# EasyEDA Pro project Photodetector_v2_1.eprj

# Schematic Schematic1
Board Name: Board1; Create Date: 2025-05-13; Page Name: P1; Project Name: Photodetector_v2; Schematic Name: Schematic1; Update Date: 2025-06-02; Company: EasyEDA.com; Page Size: A4; Version: V1.0
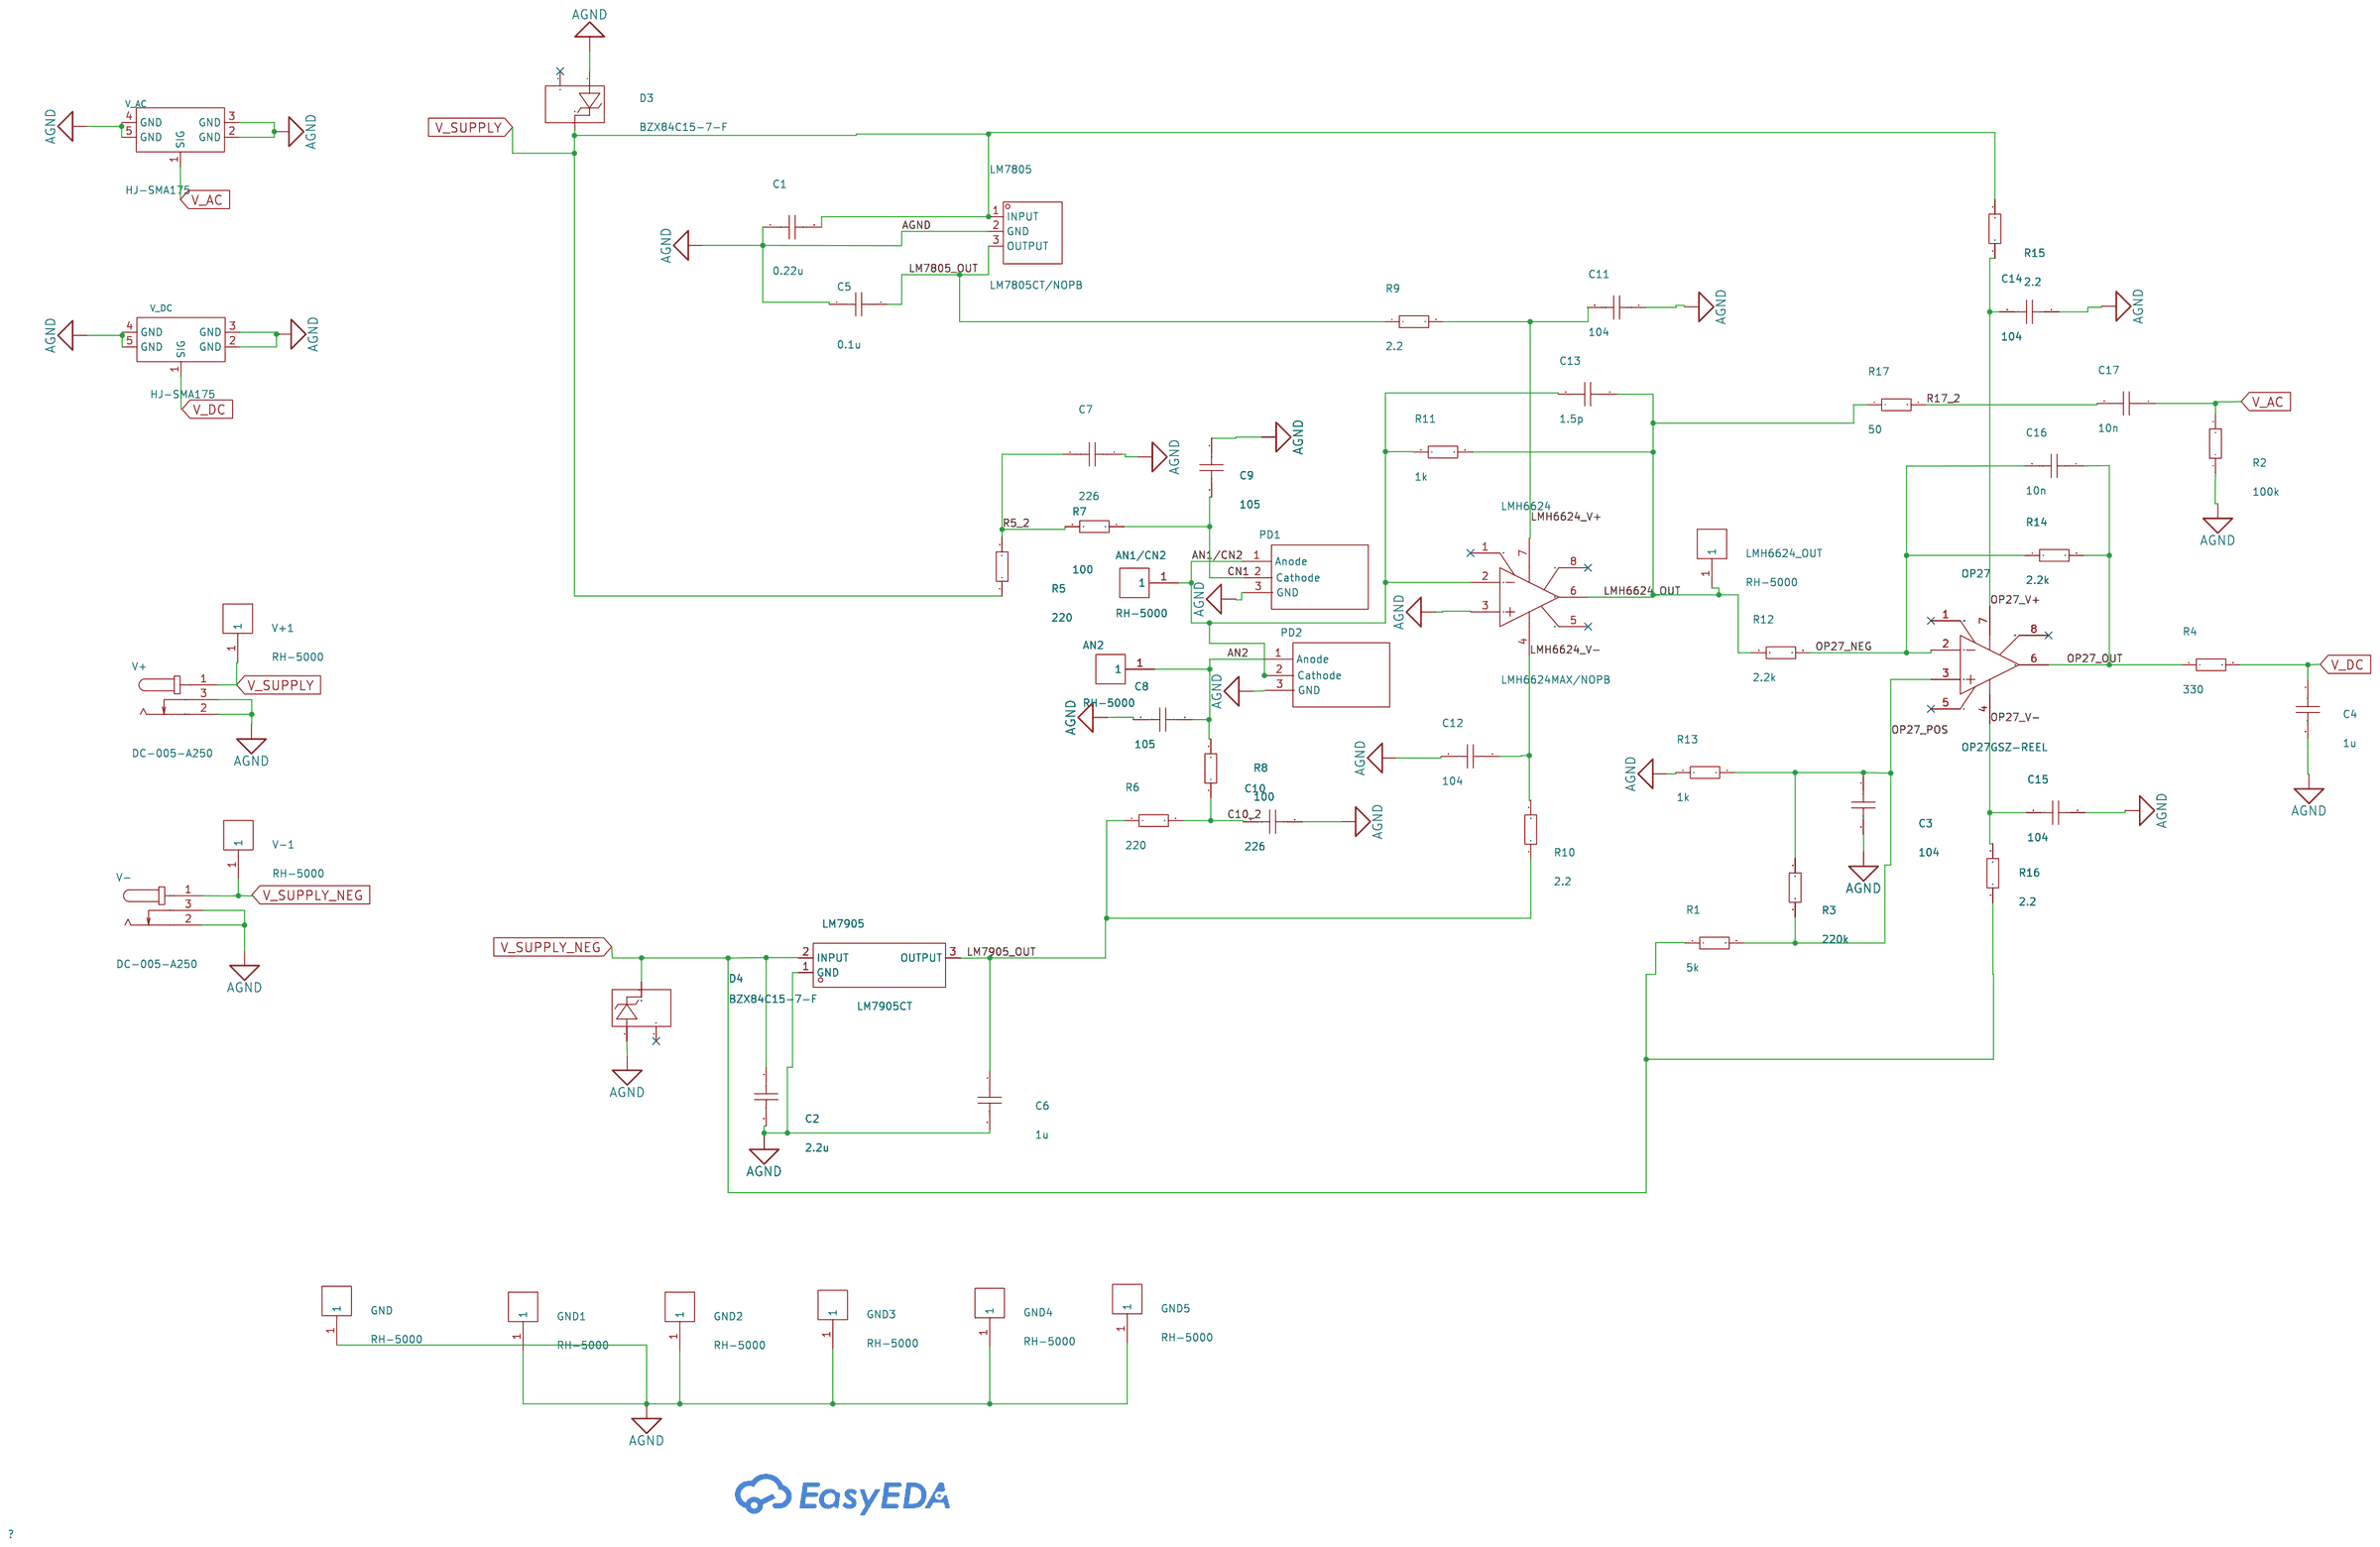
[diagram p0: schematic sheet]

## Parts
AN1/CN2  RH-5000  [TEST-TH_BD2.54-P1.4_RED]
AN2  RH-5000  [TEST-TH_BD2.54-P1.4_RED]
C1  0.22u  [C0603]
C2  2.2u  [C0603]
C3  104  [C0603]
C4  1u  [C0603]
C5  0.1u  [C0603]
C6  1u  [C0603]
C7  226  [C0603]
C8  105  [C0603]
C9  105  [C0603]
C10  226  [C0603]
C11  104  [C0603]
C12  104  [C0603]
C13  1.5p  [C0603]
C14  104  [C0603]
C15  104  [C0603]
C16  10n  [C0603]
C17  10n  [C0603]
D3  BZX84C15-7-F  [SOT-23-3_L2.9-W1.3-P1.90-LS2.4-BR]
D4  BZX84C15-7-F  [SOT-23-3_L2.9-W1.3-P1.90-LS2.4-BR]
GND  RH-5000  [TEST-TH_BD2.54-P1.4_RED]
GND1  RH-5000  [TEST-TH_BD2.54-P1.4_RED]
GND2  RH-5000  [TEST-TH_BD2.54-P1.4_RED]
GND3  RH-5000  [TEST-TH_BD2.54-P1.4_RED]
GND4  RH-5000  [TEST-TH_BD2.54-P1.4_RED]
GND5  RH-5000  [TEST-TH_BD2.54-P1.4_RED]
LM7805  LM7805CT/NOPB  [TO-220-3_L10.0-W4.5-P2.54-T]
LM7905  LM7905CT  [TO-220-3_L9.9-W4.5-P2.54-L]
LMH6624  LMH6624MAX/NOPB  [SOIC-8_L4.9-W3.9-P1.27-LS6.0-BL]
LMH6624_OUT  RH-5000  [TEST-TH_BD2.54-P1.4_RED]
OP27  OP27GSZ-REEL  [SOIC-8_L4.9-W3.9-P1.27-LS6.0-BL]
PD1  -  [HQE Detector]
PD2  -  [HQE Detector]
R1  5k  [R0603]
R2  100k  [R0603]
R3  220k  [R0603]
R4  330  [R0603]
R5  220  [R0603]
R6  220  [R0603]
R7  100  [R0603]
R8  100  [R0603]
R9  2.2  [R0603]
R10  2.2  [R0603]
R11  1k  [R0603]
R12  2.2k  [R0603]
R13  1k  [R0603]
R14  2.2k  [R0603]
R15  2.2  [R0603]
R16  2.2  [R0603]
R17  50  [R0603]
V+  DC-005-A250  [DC-IN-TH_DC-005-A250]
V+1  RH-5000  [TEST-TH_BD2.54-P1.4_RED]
V-  DC-005-A250  [DC-IN-TH_DC-005-A250]
V-1  RH-5000  [TEST-TH_BD2.54-P1.4_RED]
V_AC  HJ-SMA175  [SMA-TH_HJ-SMA175]
V_DC  HJ-SMA175  [SMA-TH_HJ-SMA175]

## Library data of the parts
AN1/CN2 AN2 GND GND1-GND5 LMH6624_OUT V+1 V-1 = RH-5000: LCSC Part Name: PCB电路板测试点/测试针; Supplier Part: C5277086; Manufacturer: 荣和; JLCPCB Part Class: Extended Part; Datasheet: https://atta.szlcsc.com/upload/public/pdf/source/20230704/1671C2774A3D6CEDC1FD6AAF48538C87.pdf; Supplier: LCSC
C1-C17 = CAP_0603: Supplier Footprint: 0603
D3 D4 = BZX84C15-7-F: Diode Configuration:Single Zener Voltage (Nom):15V Reverse Leakage Current (Ir):100nA@10.5V Zener Voltage (Range):13.8V~15.6V Zener Voltage (Range):13.8V~15.6V Power Dissipation:300mW Zener Impedance (Zzt):30Ω Tolerance:±6% Tolerance:±6%; Supplier Part: C500789; Manufacturer: DIODES(美台); Supplier Footprint: SOT-23; JLCPCB Part Class: Extended Part; Datasheet: https://atta.szlcsc.com/upload/public/pdf/source/20191127/C460825_8B7CE8DA99B73E2871EF5DDF3D9CE9A8.pdf; Supplier: LCSC; Diode Configuration: Single; Zener Voltage (Nom): 15V; Reverse Leakage Current (Ir): 100nA@10.5V; Zener Voltage (Range): 13.8V~15.6V; Power Dissipation: 300mW; Zener Impedance (Zzt): 30Ω; Tolerance: ±6%
LM7805 = LM7805CT/NOPB: Output Type:Fixed Maximum Input Voltage:35V Output Voltage:5V Output Voltage:5V Output Current:1A Power Supply Rejection Ratio (PSRR):80dB@(120Hz) Dropout Voltage:2V@(1A) standby current:6mA Feature:防静电保护；Short-Circuit  Protection；Thermal Protection(TSD)；; LCSC Part Name: 1.5A、30V 线性稳压器; Supplier Part: C50931; Manufacturer: TI(德州仪器); Supplier Footprint: TO-220; JLCPCB Part Class: Extended Part; Datasheet: https://www.ti.com/cn/lit/gpn/lm7800; Supplier: LCSC; Output Type: Fixed; Maximum Input Voltage: 35V; Output Voltage: 5V; Output Current: 1A; Power Supply Rejection Ratio (PSRR): 80dB@(120Hz); Dropout Voltage: 2V@(1A); standby current: 6mA; Feature: 防静电保护；Short-Circuit  Protection；Thermal Protection(TSD)；Overcurrent Protection(OCP)；带使能; Operating Temperature: 0℃~+125℃; Output Polarity: Positive electrode; Number of Outputs: 1
LM7905 = LM7905CT_C7432217: Output Type:Fixed Maximum Input Voltage:35V Output Voltage:5V Output Voltage:5V Output Current:1.5A Power Supply Rejection Ratio (PSRR):60dB@(120Hz) Operating Temperature:-20℃~+125℃@(Ta) Operating Temperature:-20℃~+125℃@(Ta) Output Polarity:Negative elect; Supplier Part: C7432217; Manufacturer: HGSEMI(华冠); Supplier Footprint: TO-220-3; JLCPCB Part Class: Extended Part; Datasheet: https://atta.szlcsc.com/upload/public/pdf/source/20231018/5BB71A5A92E7CAA6C954476BD60B4068.pdf; Supplier: LCSC; Output Type: Fixed; Maximum Input Voltage: 35V; Output Voltage: 5V; Output Current: 1.5A; Power Supply Rejection Ratio (PSRR): 60dB@(120Hz); Operating Temperature: -20℃~+125℃@(Ta); Output Polarity: Negative electrode; Number of Outputs: 1
LMH6624 = LMH6624MAX/NOPB: Supplier Part: C486023; Manufacturer: TI(德州仪器); Supplier Footprint: SOIC-8; JLCPCB Part Class: Extended Part; Datasheet: https://www.ti.com/cn/lit/gpn/lmh6624; Supplier: LCSC
OP27 = OP27GSZ-REEL: Number of Circuits:单路 Gain Bandwidth Product(GBP):8MHz Current - Input Bias(Ib):15nA Slew Rate(SR):2.8V/us Output Current:- -3db Bandwidth:- Operating Temperature:-40℃~+85℃ Operating Temperature:-40℃~+85℃; Supplier Part: C581242; Manufacturer: ADI(亚德诺); Supplier Footprint: SOIC-8; JLCPCB Part Class: Extended Part; Datasheet: https://atta.szlcsc.com/upload/public/pdf/source/20190807/C408903_306E85C5C164A1857E665ACBE0030C2C.pdf; Supplier: LCSC; Number of Circuits: 单路; Gain Bandwidth Product(GBP): 8MHz; Current - Input Bias(Ib): 15nA; Slew Rate(SR): 2.8V/us; Operating Temperature: -40℃~+85℃
PD1 PD2 = PD
R1-R17 = Res_0603: Supplier Footprint: 0603
V+ V- = DC-005-A250: Connector Type:DC Power Receptacle Mounting Style:Bend insert Inside Contact Diameter:2.5mm Outside Contact Diameter:6.3mm Current Rating (Max):3A Voltage Rating (Max):30V Operating Temperature Range:-20℃~+70℃ Operating Temperature Range:-20℃~+70℃; LCSC Part Name: DC电源插座 内径:2.5mm 外径:6.3mm; Supplier Part: C720558; Manufacturer: XUNPU(讯普); Supplier Footprint: 插件; JLCPCB Part Class: Extended Part; Datasheet: https://atta.szlcsc.com/upload/public/pdf/source/20220428/F133011953B124341225656709BD6AA6.pdf; Supplier: LCSC; Connector Type: DC Power Receptacle; Mounting Style: Bend insert; Inside Contact Diameter: 2.5mm; Outside Contact Diameter: 6.3mm; Current Rating (Max): 3A; Voltage Rating (Max): 30V; Operating Temperature Range: -20℃~+70℃
V_AC V_DC = HJ-SMA175: Connector Type:板端 Interface Type:内孔 Number of Ports:1 Interface Diameter:5.35mm Interface Length/Height:11mm Frequency-Max:- RF Series:SMA Impedance:- Style:弯头 Operating Temperature Range:- Operating Temperature Range:-; LCSC Part Name: SMA 内孔 弯头 两件套; Supplier Part: C1509213; Manufacturer: 皇捷; Supplier Footprint: 插件; JLCPCB Part Class: Extended Part; Datasheet: https://atta.szlcsc.com/upload/public/pdf/source/20201224/C1509213_FEE037D2D73503198C916572913C3C1F.pdf; Supplier: LCSC; Connector Type: 板端; Interface Type: 内孔; Number of Ports: 1; Interface Diameter: 5.35mm; Interface Length/Height: 11mm; RF Series: SMA; Style: 弯头

## Nets
AGND: C1.1 C2.2 C4.2 C5.1 C6.2 C7.1 C8.2 C9.1 C10.1 C11.1 C12.2 C14.1 C15.1 D4.1 GND.1 GND1.1 GND2.1 GND3.1 GND4.1 GND5.1 LM7805.2(GND) LM7905.1(GND) LMH6624.3(IN+) PD1.3(GND) R2.1 R13.1 V+.2 V+.3 V-.2 V-.3 V_AC.2(GND) V_AC.3(GND) V_AC.4(GND) V_AC.5(GND) V_DC.2(GND) V_DC.3(GND) V_DC.4(GND) V_DC.5(GND)
AN1/CN2: AN1/CN2.1 C13.2 LMH6624.2(IN-) PD1.1(Anode) PD2.2(Cathode) R11.1
AN2: AN2.1 C8.1 PD2.1(Anode) R8.2
C10_2: C10.2 R6.2 R8.1
CN1: C9.2 PD1.2(Cathode) R7.1
LM7805_OUT: C5.2 LM7805.3(OUTPUT) R9.1
LM7905_OUT: LM7905.3(OUTPUT) R6.1 R10.1
LMH6624_OUT: C13.1 LMH6624.6(OUT) LMH6624_OUT.1 R11.2 R12.1 R17.1
LMH6624_V+: C11.2 LMH6624.7(V+) R9.2
LMH6624_V-: C12.1 LMH6624.4(V-) R10.2
OP27_NEG: C16.2 OP27.2(IN-) R12.2 R14.1
OP27_OUT: C16.1 OP27.6(OUT) R14.2
OP27_POS: C3.1 OP27.3(IN+) R1.2 R3.1 R3.2 R13.2
OP27_V+: C14.2 OP27.7(V+) R15.1
OP27_V-: C15.2 OP27.4(V-) R16.2
R5_2: C7.2 R5.2 R7.2
R17_2: C17.2 R17.2
V_AC: C17.1 R2.2 V_AC.1(SIG)
V_DC: C4.1 R4.2 V_DC.1(SIG)
V_SUPPLY: C1.2 D3.3 LM7805.1(INPUT) R5.1 R15.2 V+.1 V+1.1
V_SUPPLY_NEG: C2.1 D4.3 R1.1 V-.1 V-1.1

Not connected (* = marked no-connect by the designer): C3 2; C6 1; D3 1 2*; D4 2*; LM7905 2(INPUT); LMH6624 1(NC)* 5(NC)* 8(NC)*; OP27 1(VOS TRIM)* 5(NC)* 8(VOS TRIM)*; PD2 3(GND); R4 1; R16 1

# Board PCB1
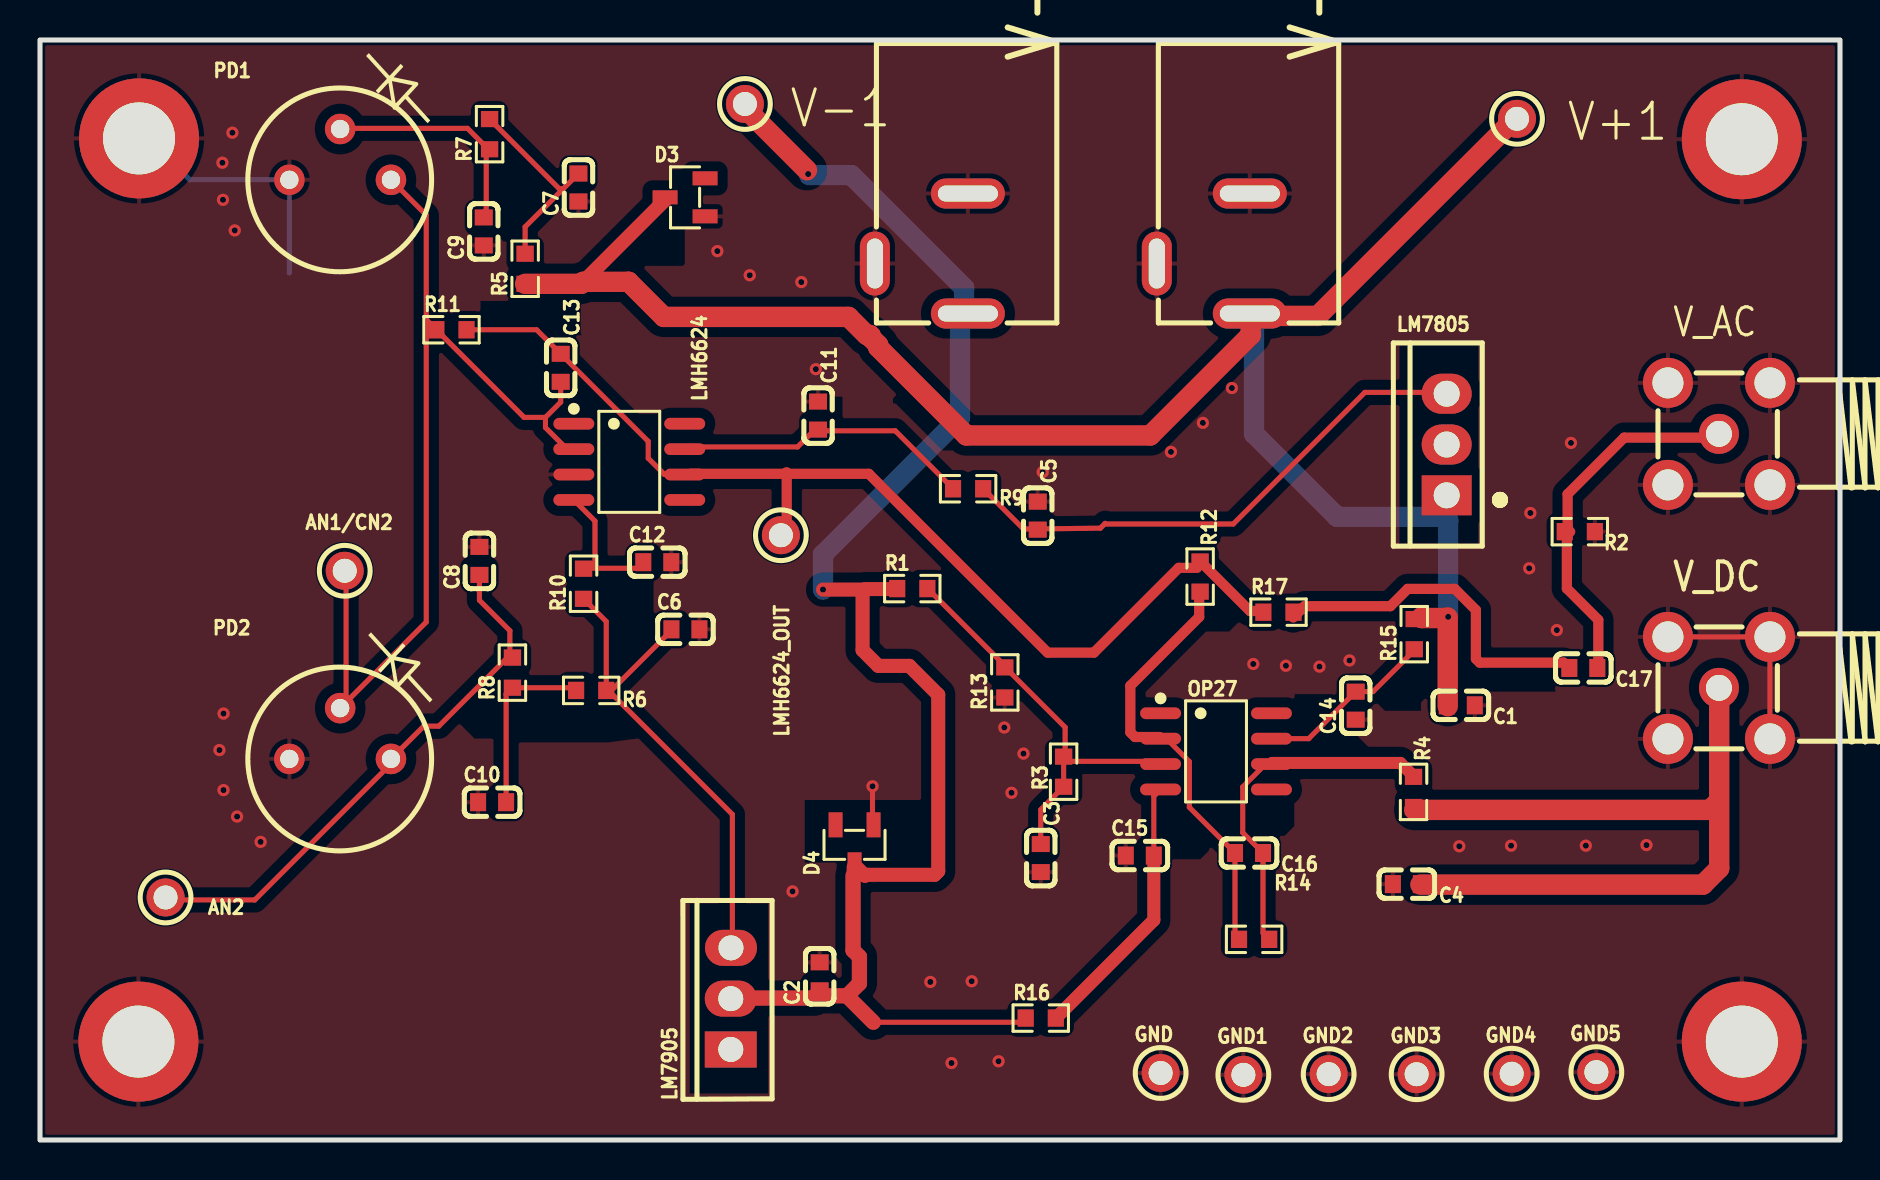
[diagram p1: board, top side]
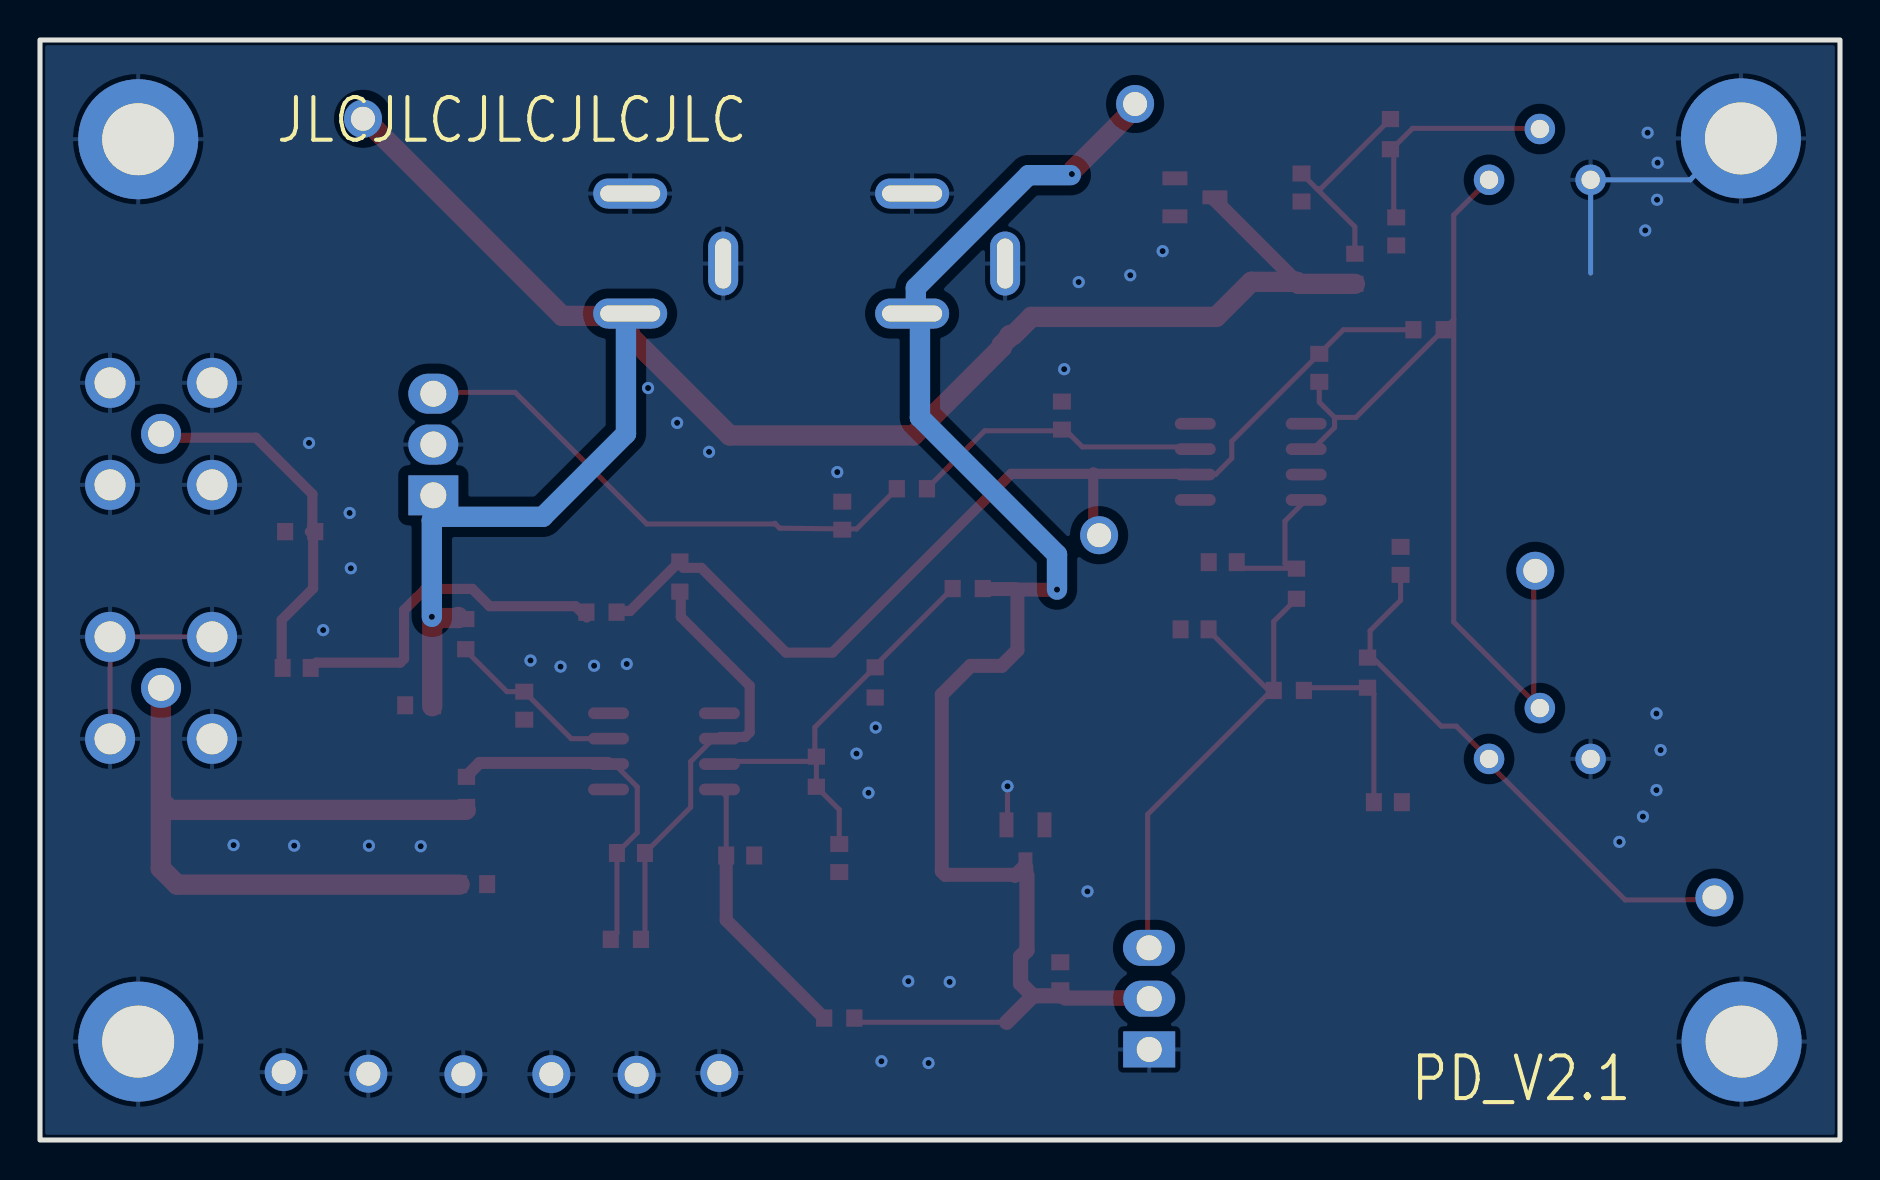
[diagram p2: board, bottom side, seen from below]

Outline 90 x 55 mm; copper layers: Top Layer, Bottom Layer. Coordinates in mm from the lower left corner of the outline.
Outline path: rectangle 0,55 90,0
Stack: Top Layer 0.035mm / Dielectric1 1.51mm FR4 er 4.5 / Bottom Layer 0.035mm

## Design rules (mm)
template: Custom Config
spacing copperThickness1oz (default): track to track 0.102, other pairs 0.152 to 0.3
spacing copperThickness2oz: track to track 0.203, other pairs 0.152 to 0.3
track width copperThickness1oz (default): min 0.127, default 0.254, max 2.54
track width copperThickness2oz: min 0.203, default 0.254, max 2.54
differential pair differentialPair (default): width min 0.127, default 0.254, max 2.54; gap min 0.152, default 0.152
via viaSize (default): diameter min 0.5, default 0.61, max 10; hole min 0.3, default 0.305, max 6.3

## Placement (name value [footprint] x y rotation side)
AN1/CN2  RH-5000  [TEST-TH_BD2.54-P1.4_RED]  15.24 28.46 0 top
AN2  RH-5000  [TEST-TH_BD2.54-P1.4_RED]  6.28 12.13 0 top
C1  0.22u  [C0603]  71.04 21.73 180 top
C2  2.2u  [C0603]  38.98 8.18 90 top
C3  104  [C0603]  50.04 14.1 270 top
C4  1u  [C0603]  68.34 12.79 180 top
C5  0.1u  [C0603]  49.89 31.22 270 top
C6  1u  [C0603]  32.27 25.53 0 top
C7  226  [C0603]  26.92 47.62 90 top
C8  105  [C0603]  21.97 28.96 90 top
C9  105  [C0603]  22.19 45.43 90 top
C10  226  [C0603]  22.61 16.89 0 top
C11  104  [C0603]  38.9 36.22 270 top
C12  104  [C0603]  30.86 28.89 0 top
C13  1.5p  [C0603]  26.03 38.61 270 top
C14  104  [C0603]  65.79 21.72 90 top
C15  104  [C0603]  54.99 14.22 0 top
C16  10n  [C0603]  60.45 14.35 180 top
C17  10n  [C0603]  77.17 23.6 180 top
D3  BZX84C15-7-F  [SOT-23-3_L2.9-W1.3-P1.90-LS2.4-BR]  32.25 47.13 0 top
D4  BZX84C15-7-F  [SOT-23-3_L2.9-W1.3-P1.90-LS2.4-BR]  40.73 14.76 90 top
GND  RH-5000  [TEST-TH_BD2.54-P1.4_RED]  56.03 3.35 0 top
GND1  RH-5000  [TEST-TH_BD2.54-P1.4_RED]  60.17 3.26 0 top
GND2  RH-5000  [TEST-TH_BD2.54-P1.4_RED]  64.43 3.29 0 top
GND3  RH-5000  [TEST-TH_BD2.54-P1.4_RED]  68.83 3.29 0 top
GND4  RH-5000  [TEST-TH_BD2.54-P1.4_RED]  73.58 3.31 0 top
GND5  RH-5000  [TEST-TH_BD2.54-P1.4_RED]  77.82 3.39 0 top
LM7805  LM7805CT/NOPB  [TO-220-3_L10.0-W4.5-P2.54-T]  70.33 34.77 180 top
LM7905  LM7905CT  [TO-220-3_L9.9-W4.5-P2.54-L]  34.54 7.07 90 top
LMH6624  LMH6624MAX/NOPB  [SOIC-8_L4.9-W3.9-P1.27-LS6.0-BL]  29.46 33.91 270 top
LMH6624_OUT  RH-5000  [TEST-TH_BD2.54-P1.4_RED]  37.04 30.24 0 top
NOREF  -  [Pad_e1035]  85.09 50.04 0 top
NOREF#2  -  [Pad_e1034]  4.95 50.08 0 top
NOREF#3  -  [Pad_e1036]  85.09 4.92 0 top
NOREF#4  -  [Pad_e1032]  4.92 4.92 0 top
OP27  OP27GSZ-REEL  [SOIC-8_L4.9-W3.9-P1.27-LS6.0-BL]  58.8 19.43 270 top
PD1  -  [HQE Detector]  14.99 48.01 0 top
PD2  -  [HQE Detector]  14.99 19.05 0 top
R1  5k  [R0603]  43.61 27.57 0 top
R2  100k  [R0603]  76.99 30.42 180 top
R3  220k  [R0603]  51.18 18.42 90 top
R4  330  [R0603]  68.68 17.4 270 top
R5  220  [R0603]  24.26 43.56 90 top
R6  220  [R0603]  27.56 22.48 180 top
R7  100  [R0603]  22.48 50.29 90 top
R8  100  [R0603]  23.62 23.37 90 top
R9  2.2  [R0603]  46.41 32.56 180 top
R10  2.2  [R0603]  27.18 27.81 90 top
R11  1k  [R0603]  20.57 40.51 0 top
R12  2.2k  [R0603]  58.01 28.17 270 top
R13  1k  [R0603]  48.24 22.88 90 top
R14  2.2k  [R0603]  60.71 10.03 0 top
R15  2.2  [R0603]  68.71 25.29 90 top
R16  2.2  [R0603]  50.04 6.1 0 top
R17  50  [R0603]  61.92 26.39 0 top
V+  DC-005-A250  [DC-IN-TH_DC-005-A250]  58.17 44.32 270 top
V+1  RH-5000  [TEST-TH_BD2.54-P1.4_RED]  73.85 51.06 0 top
V-  DC-005-A250  [DC-IN-TH_DC-005-A250]  44.07 44.32 270 top
V-1  RH-5000  [TEST-TH_BD2.54-P1.4_RED]  35.25 51.8 0 top
V_AC  HJ-SMA175  [SMA-TH_HJ-SMA175]  83.95 35.31 180 top
V_DC  HJ-SMA175  [SMA-TH_HJ-SMA175]  83.95 22.61 180 top

## Footprints (pads in the part's own frame, mm; a bottom-side part is the same pattern mirrored in y, then rotated)
C0603
  rect 0.8x0.9 smd: 1(-0.7,0) 2(0.7,0)
DC-IN-TH_DC-005-A250
  oval 1.5x3.7 hole 0.8x3: 1(3,2.325) 2(-3,2.325)
  oval 3.2x1.5 hole 2.5x0.8: 3(0.5,-2.325)
HQE Detector
  round 1.524 hole 0.914: 1(2.562,0.004) 2(0.022,2.544) 3(-2.518,0.004)
Pad_e1032
  round 6 hole 3.6: 1(0,0)
Pad_e1034
  round 6 hole 3.6: 1(0,0)
Pad_e1035
  round 6 hole 3.6: 2(0,0)
Pad_e1036
  round 6 hole 3.6: 3(0,0)
R0603
  rect 0.806x0.864 smd: 1(-0.753,0) 2(0.753,0)
SMA-TH_HJ-SMA175
  round 2 hole 1.3: 1(0,0)
  round 2.5 hole 1.55: 2(-2.55,2.55) 3(-2.55,-2.55) 4(2.55,-2.55) 5(2.55,2.55)
SOIC-8_L4.9-W3.9-P1.27-LS6.0-BL
  oval 0.588x2.045 smd: 1(-1.905,-2.772) 2(-0.635,-2.772) 3(0.635,-2.772) 4(1.905,-2.772) 5(1.905,2.772) 6(0.635,2.772) 7(-0.635,2.772) 8(-1.905,2.772)
SOT-23-3_L2.9-W1.3-P1.90-LS2.4-BR
  rect 1.25x0.7 smd: 1(1,-0.95) 2(1,0.95) 3(-1,0)
TEST-TH_BD2.54-P1.4_RED
  round 1.9 hole 1.2: 1(0,0)
TO-220-3_L9.9-W4.5-P2.54-L
  rect 1.8x2.6 hole 1.25: 1(-2.54,0.005)
  oval 1.8x2.6 hole 1.25: 2(0,0.005) 3(2.54,-0.005)
TO-220-3_L10.0-W4.5-P2.54-T
  rect 2.5x2 hole 1.3: 1(0,2.54)
  oval 2.5x2 hole 1.3: 2(0,0) 3(0,-2.54)

## Nets
As in the schematic, except:
AGND: C1.1 C2.2 C3.2 C4.2 C5.1 C6.2 C7.1 C8.2 C9.1 C10.1 C11.1 C12.2 C14.1 C15.1 D3.1 D4.1 GND.1 GND1.1 GND2.1 GND3.1 GND4.1 GND5.1 LM7805.2 LM7905.1 LMH6624.3 NOREF.2 NOREF#2.1 NOREF#3.3 NOREF#4.1 PD1.3 PD2.3 R2.1 R13.1 V+.2 V+.3 V-.2 V-.3 V_AC.2 V_AC.3 V_AC.4 V_AC.5 V_DC.2 V_DC.3 V_DC.4 V_DC.5
LM7905_OUT: C6.1 LM7905.3 R6.1 R10.1
OP27_OUT: C16.1 OP27.6 R4.1 R14.2
V_SUPPLY_NEG: C2.1 D4.3 LM7905.2 R1.1 R16.1 V-.1 V-1.1

Pads without a net: D3 2; D4 2; LMH6624 1 5 8; OP27 1 5 8

## Via types
v1: diameter 0.61, hole 0.305, Top Layer to Bottom Layer, 41 vias

## Routing (per net, layer and track width the routed paths; a pad name or vN(x,y) marks a point on that pad's centre or on a via; arc(x,y) is an arc through that point)
AGND: length 25.6
  Top Layer w0.254: V_DC.4 V_DC.3 V_DC.2 ; 48.25,22.13 48.24,22.13 ; 48.28,22.14 48.28,22.13 ; 41.5,15.8 41.63,15.92 v1(41.63,17.69)
  Bottom Layer w0.254: 12.47,43.35 PD1.3 7.49,48.01 4.83,50.67
  vias: v1(8.97,19.5) v1(9.12,48.86) v1(9.15,47.01) v1(9.18,21.32) v1(9.18,17.5) v1(9.62,50.36) v1(9.74,45.48) v1(9.85,16.17) v1(11.03,14.91) v1(33.87,44.44) v1(35.49,43.24) v1(37.63,12.43) v1(38.07,42.9) v1(38.79,38.54) v1(44.52,7.9) v1(45.57,3.85) v1(46.58,7.94) v1(47.93,3.94) v1(48.22,20.62) v1(48.58,17.36) v1(49.17,19.32) v1(50.14,33.4) v1(56.55,34.41) v1(58.14,35.86) v1(59.6,37.6) v1(60.66,23.8) v1(62.3,23.71) v1(63.97,23.67) v1(65.47,23.98) v1(70.96,14.69) v1(73.55,14.72) v1(74.52,31.35) v1(74.46,28.59) v1(75.84,25.5) v1(76.55,34.85) v1(77.29,14.72) v1(80.32,14.75)
AN1/CN2: length 48.7
  Top Layer w0.254: 19.31,41.02 R11.1 24.2,36.13 25.27,36.13 ; 19.31,41.02 19.31,46.25 PD1.1 ; 19.31,41.02 19.31,25.9 15.3,21.89 ; 15.3,21.89 15.3,28.58 ; 15.3,21.89 15.3,21.87 14.85,21.42 ; 15.3,21.89 PD2.2 ; 25.27,36.13 26.03,36.89 C13.2 ; 25.27,36.13 25.27,35.62 26.29,34.61 26.63,34.61 LMH6624.2
AN2: length 27.2
  Top Layer w0.254: 6.4,12 10.74,12 17.75,19.02 ; 23.5,24.25 23.5,25.46 21.97,26.99 C8.1 ; 23.5,24.25 R8.2 ; 23.5,24.25 19.94,20.69 19.19,20.69 PD2.1
C10_2: length 9.1
  Top Layer w0.254: R6.2 26.67,22.61 R8.1 23.31,22.3 C10.2
CN1: length 11.1
  Top Layer w0.254: 22.31,49.45 22.31,46.51 22.17,46.37 ; 22.45,49.5 21.37,50.58 14.94,50.58
LM7805_OUT: length 27
  Top Layer w0.254: 53.23,30.8 53.02,30.59 49.86,30.55 ; 53.23,30.8 59.66,30.8 66.24,37.38 70.28,37.38 70.35,37.31 ; 53.23,30.8 53.27,30.84 ; 49.86,30.55 49.17,30.55 47.18,32.54 ; 49.86,30.55 49.94,30.55
LM7905_OUT: length 23.8
  Top Layer w0.254: 34.62,10.55 34.62,16.28 28.39,22.5 ; 28.31,22.5 28.31,25.93 R10.1 ; 28.57,22.48 31.58,25.49
LMH6624_OUT: length 52.7
  Top Layer w0.254: 32.14,33.27 31.22,33.27 30.41,34.09 30.41,34.93 C13.1 24.83,40.51 R11.2
  Top Layer w0.508: 37.34,33.31 41.44,33.31 50.38,24.37 52.7,24.37 56.94,28.61 57.85,28.61 ; 37.34,33.31 37.34,30.51 37.03,30.21 ; 37.34,33.31 37.34,33.38 ; 61.16,26.45 60.5,26.45 58,28.95 ; 37.28,33.36 37.3,33.34 ; 32.5,33.31 37.28,33.31 ; 58.05,28.81 58.13,28.81
LMH6624_V+: length 14.7
  Top Layer w0.254: 32.41,34.65 37.88,34.65 38.77,35.55 ; 45.6,32.62 42.76,35.46 38.83,35.46
LMH6624_V-: length 7.4
  Top Layer w0.254: 30.24,28.88 29.94,28.59 27.23,28.59 ; LMH6624.4 27.75,30.94 27.75,28.83 27.44,28.83 27.23,28.61 27.17,28.61
OP27_NEG: length 21.5
  Top Layer w0.254: R14.1 59.75,10.23 C16.2 57.47,16.64 57.47,18.92 56.41,19.98
  Top Layer w0.508: 57.96,27.43 57.96,26.15 54.52,22.71 54.52,20.39 54.75,20.15 55.97,20.15 55.99,20.13
OP27_OUT: length 17.5
  Top Layer w0.254: R14.2 61.15,10.34 C16.1 60.14,15.37 60.14,17.65 61.28,18.8 OP27.6
  Top Layer w0.6: 61.6,18.85 68.02,18.85 68.72,18.15
OP27_POS: length 20.8
  Top Layer w0.254: C3.1 50.04,16.52 R3.1 51.18,18.93 55.89,18.93 OP27.3 ; 44.31,27.65 48.25,23.7 ; 48.24,23.66 51.26,20.64 51.26,19.19 51.23,19.16
OP27_V+: length 9
  Top Layer w0.254: 68.66,24.43 66.65,22.42 65.66,22.42 ; OP27.7 63.44,20.07 C14.2
OP27_V-: length 13.6
  Top Layer w0.254: OP27.4 55.69,17.19 C15.2
  Top Layer w0.65: R16.2 55.69,11 C15.2
R5_2: length 10.2
  Top Layer w0.254: R7.2 25.96,47.56 26.16,47.56 ; 26.16,47.56 C7.2 ; 26.16,47.56 24.26,45.66 R5.2
R17_2: length 17.5
  Top Layer w0.508: 76.48,23.58 76.18,23.87 71.99,23.87 71.8,24.06 71.8,26.5 70.74,27.55 68.38,27.55 67.52,26.69 63.23,26.69 62.66,26.13
V_AC: length 18.2
  Top Layer w0.508: 83.91,35.33 83.7,35.12 79.21,35.12 76.38,32.29 76.38,30.54 76.51,30.41 ; 76.29,30.37 76.34,30.32 76.34,27.58 77.92,26 77.92,23.58
V_DC: length 39.7
  Top Layer w1.016: 83.96,22.63 83.96,13.58 83.15,12.77 69.02,12.77 ; 83.89,16.9 83.5,16.5 68.71,16.5
V_SUPPLY: length 94.1
  Top Layer w0.254: 70.38,26.13 v1(70.41,26.16)
  Top Layer w0.7: 27.16,42.91 31.29,47.04 31.29,47.06
  Top Layer w1.016: 27.02,42.81 R5.1 ; 73.79,51.11 63.89,41.2 60.68,41.2 ; 41.49,40.26 41.54,40.21 41.54,40.13 41.91,39.75 41.91,39.63 46.32,35.23 55.51,35.23 60.54,40.25 60.54,41.1 60.58,41.14 60.58,41.16 ; 69.09,26.15 69.09,26.1 70.35,26.1 ; 41.34,40.24 40.43,41.15 31.19,41.15 29.44,42.91 27.16,42.91 27.06,42.81 27.04,42.81 ; 70.39,26.13 70.39,21.69
  Bottom Layer w1.016: 70.41,30.99 70.41,30.98 v1(70.41,26.16) ; 70.4,32.12 70.36,32.08 70.36,31.24 ; 70.06,31.16 64.86,31.16 60.7,35.31 60.7,41.24
V_SUPPLY_NEG: length 78.5
  Top Layer w0.254: 49.17,6.12 48.93,5.89 41.67,5.89
  Top Layer w0.7: 40.82,13.65 41.25,13.22 41.25,13.22 41.4,13.26 44.73,13.26 44.91,13.44 44.91,22.26 43.47,23.71 41.91,23.71 41.13,24.49 41.13,27.51 ; 41.26,27.55 42.75,27.55 42.79,27.51 ; v1(39.15,27.52) 41.23,27.52
  Top Layer w0.762: 40.35,7.21 40.35,7.21 41.67,5.89 ; 40.35,7.21 40.38,7.21 ; 40.35,7.21 40.97,7.83 40.97,9.16 40.65,9.48 40.65,13.23 ; 40.35,7.21 39.03,7.21 38.88,7.36 ; 38.73,7.1 34.75,7.1 34.54,6.9 ; 40.72,13.29 40.72,13.64
  Top Layer w1.016: 35.14,51.7 38.35,48.49
  Bottom Layer w1.016: v1(39.15,27.52) 39.15,29.27 46,36.13 46,40.93 ; 46.21,41.61 46.21,42.61 40.57,48.24 38.46,48.24
  vias: v1(38.41,48.3)

## Copper pours and planes (outline as drawn; the poured copper is in the pictures)
AGND on Top Layer: 0,55 90,55 90,0 0,0
AGND on Bottom Layer: 0,55 90,55 90,0 0,0

## Text on the board
Bottom Silkscreen Layer: PD_V2.1 | JLCJLCJLCJLCJLC
Top Silkscreen Layer: V_AC | V_DC
